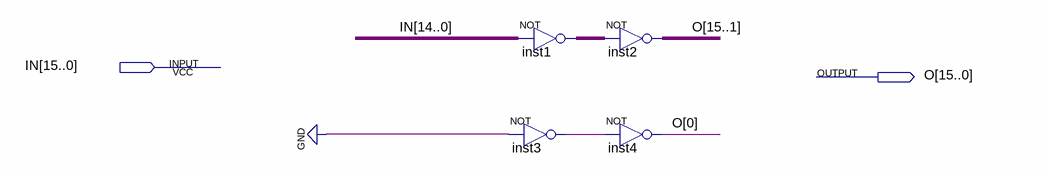
[diagram p0: schematic sheet]
// Quartus schematic SHIFT1.bdf as structural Verilog: 4 symbols, 2 pins
module SHIFT1 (
  input  [15:0] IN,
  output [15:0] O
);

  wire inst3_out;
  wire [14:0] inst1_out;

  assign inst1_out = ~IN[14:0];  // NOT inst1, 15 bits wide
  not inst3 (inst3_out, 1'b0);
  assign O[15:1] = ~inst1_out;  // NOT inst2, 15 bits wide
  not inst4 (O[0], inst3_out);
endmodule
